# EAGLE design edubrm-shield (EAGLE 5.11)
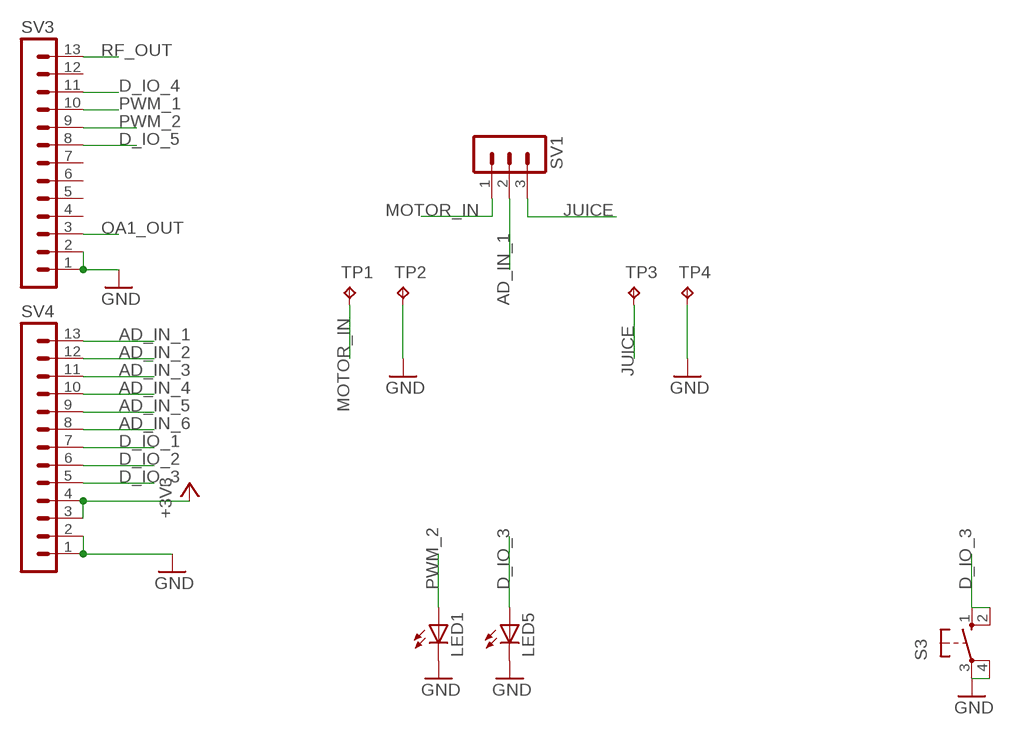
[diagram p0: schematic, sheet 1]

## Parts
LED1  LED3MM  [LED3MM]
LED5  LED3MM  [LED3MM]
S3  10-XX  [B3F-10XX]
SV1  MA03-1  [MA03-1]
SV3  MA13-1  [MA13-1]
SV4  MA13-1  [MA13-1]
TP1  TPPAD1-20Y  [P1-20Y]
TP2  TPPAD1-20Y  [P1-20Y]
TP3  TPPAD1-20Y  [P1-20Y]
TP4  TPPAD1-20Y  [P1-20Y]

## Nets
AD_IN_1: SV1.2 SV4.13
AD_IN_2: SV4.12
AD_IN_3: SV4.11
AD_IN_4: SV4.10
AD_IN_5: SV4.9
AD_IN_6: SV4.8
D_IO_1: SV4.7
D_IO_2: SV4.6
D_IO_3: LED5.A S3.1(S) S3.2(S1) SV4.5
D_IO_4: SV3.11
D_IO_5: SV3.8
GND: LED1.K(C) LED5.K(C) S3.3(P) S3.4(P1) SV3.1 SV3.2 SV4.1 SV4.2 TP2.TP TP4.TP
JUICE: SV1.3 TP3.TP
MOTOR_IN: SV1.1 TP1.TP
OA1_OUT: SV3.3
PWM_1: SV3.10
PWM_2: LED1.A SV3.9
RF_OUT: SV3.13
VCC: SV4.3 SV4.4 ; supply symbol labelled +3V3
Unconnected: SV3.4 SV3.5 SV3.6 SV3.7 SV3.12

## Library data of the parts
LED1 LED5 = led:LED: LED OSRAM: - CHIPLED LG R971, LG N971, LY N971, LG Q971, LY Q971, LO R971, LY R971 LH N974, LH R974 LS Q976, LO Q976, LY Q976 LO Q996 - Hyper CHIPLED LW Q18S LB Q993, LB Q99A, LB R99A - SideLED LS A670, LO A670, LY A670, LG A670, LP A670 LB A673, LV A673, LT A673, LW A673 LH A674 LY A675 LS A676, LA A676, LO A676, LY A676, LW A676 LS A679, LY A679, LG A679 - Hyper Micro SIDELED® LS Y876, LA Y876, LO Y876, LY Y876 LT Y87S - SmartLED LW L88C, LW L88S LB L89C, LB L89S, LG L890 LS L89K, LO L89K, LY L89K LS L896, LA L896, LO L896, LY L896 - TOPLED LS T670, LO T670, LY T670, LG T670, LP T670 LSG T670, LSP T670, LSY T670, LOP T670, LYG T670 LG T671, LOG T671, LSG T671 LB T673, LV T673, LT T673, LW T673 LH T674 LS T676, LA T676, LO T676, LY T676, LB T676, LH T676, LSB T676, LW T676 LB T67C, LV T67C, LT T67C, LS T67K, LO T67K, LY T67K, LW E67C LS E67B, LA E67B, LO E67B, LY E67B, LB E67C, LV E67C, LT E67C LW T67C LS T679, LY T679, LG T679 LS T770, LO T770, LY T770, LG T770, LP T770 LB T773, LV T773, LT T773, LW T773 LH T774 LS E675, LA E675, LY E675, LS T675 LS T776, LA T776, LO T776, LY T776, LB T776 LHGB T686 LT T68C, LB T68C - Hyper Mini TOPLED® LB M676 - Mini TOPLED Santana® LG M470 LS M47K, LO M47K, LY M47K Source: http://www.osram.convergy.de LUXEON: - LUMILED® LXK2-PW12-R00, LXK2-PW12-S00, LXK2-PW14-U00, LXK2-PW14-V00 LXK2-PM12-R00, LXK2-PM12-S00, LXK2-PM14-U00 LXK2-PE12-Q00, LXK2-PE12-R00, LXK2-PE12-S00, LXK2-PE14-T00, LXK2-PE14-U00 LXK2-PB12-K00, LXK2-PB12-L00, LXK2-PB12-M00, LXK2-PB14-N00, LXK2-PB14-P00, LXK2-PB14-Q00 LXK2-PR12-L00, LXK2-PR12-M00, LXK2-PR14-Q00, LXK2-PR14-R00 LXK2-PD12-Q00, LXK2-PD12-R00, LXK2-PD12-S00 LXK2-PH12-R00, LXK2-PH12-S00 LXK2-PL12-P00, LXK2-PL12-Q00, LXK2-PL12-R00 Source: www.luxeon.com KINGBRIGHT: KA-3528ASYC Source: www.kingbright.com
S3 = switch-omron:10-XX: OMRON SWITCH; MPN: B3F-1000; OC_FARNELL: 176432; OC_NEWARK: 36M3542
SV1 = con-lstb:MA03-1: PIN HEADER; OC_FARNELL: unknown; OC_NEWARK: unknown
SV3 SV4 = con-lstb:MA13-1: PIN HEADER; OC_FARNELL: unknown; OC_NEWARK: unknown
TP1-TP4 = testpad:TP: Test pad

## Board
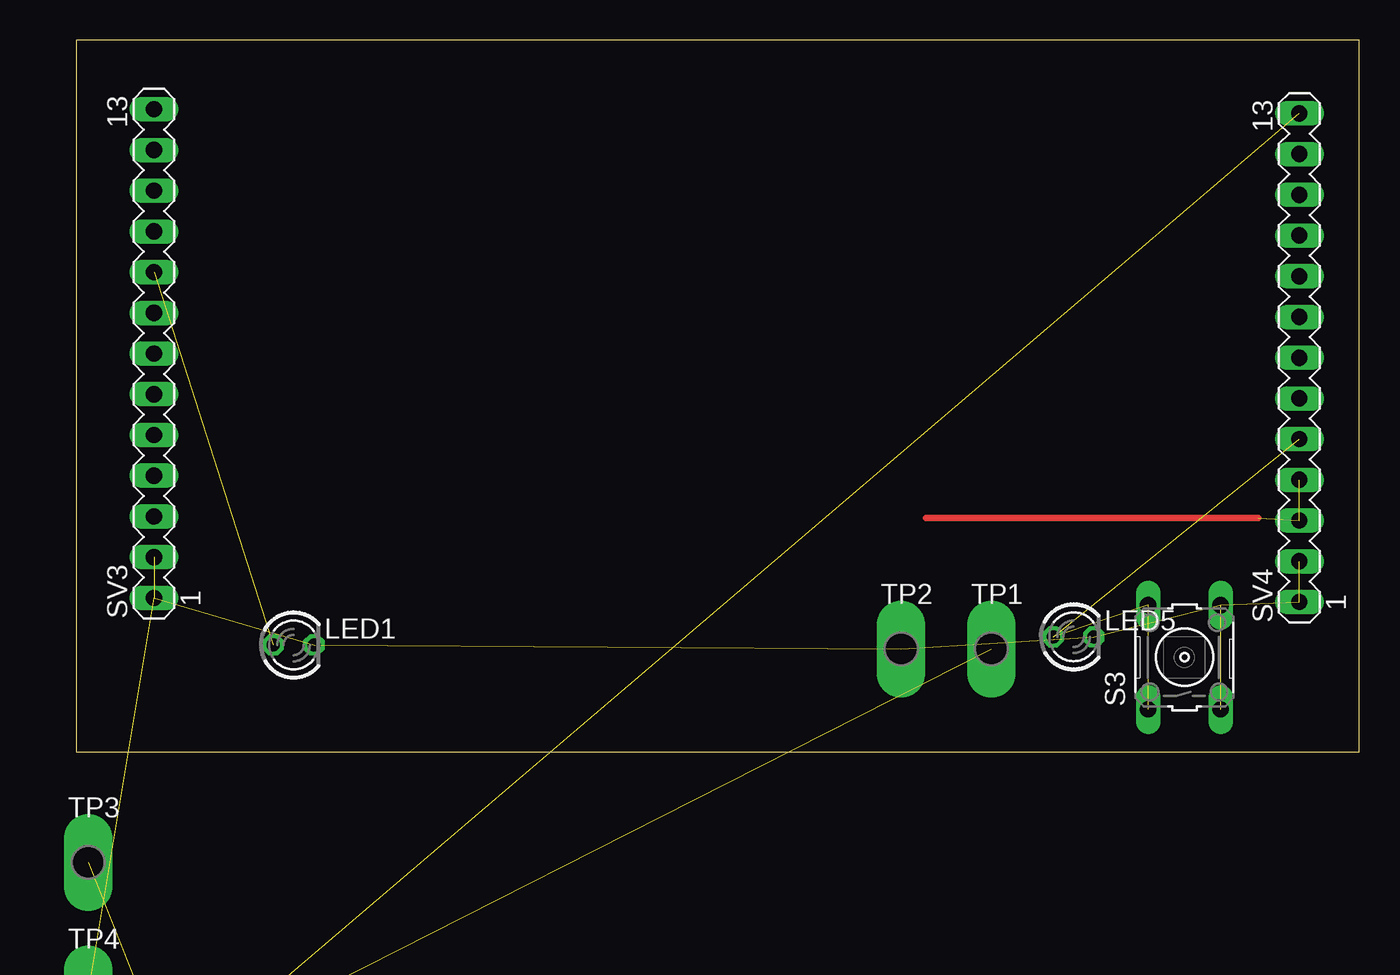
[diagram p1: board, top side]
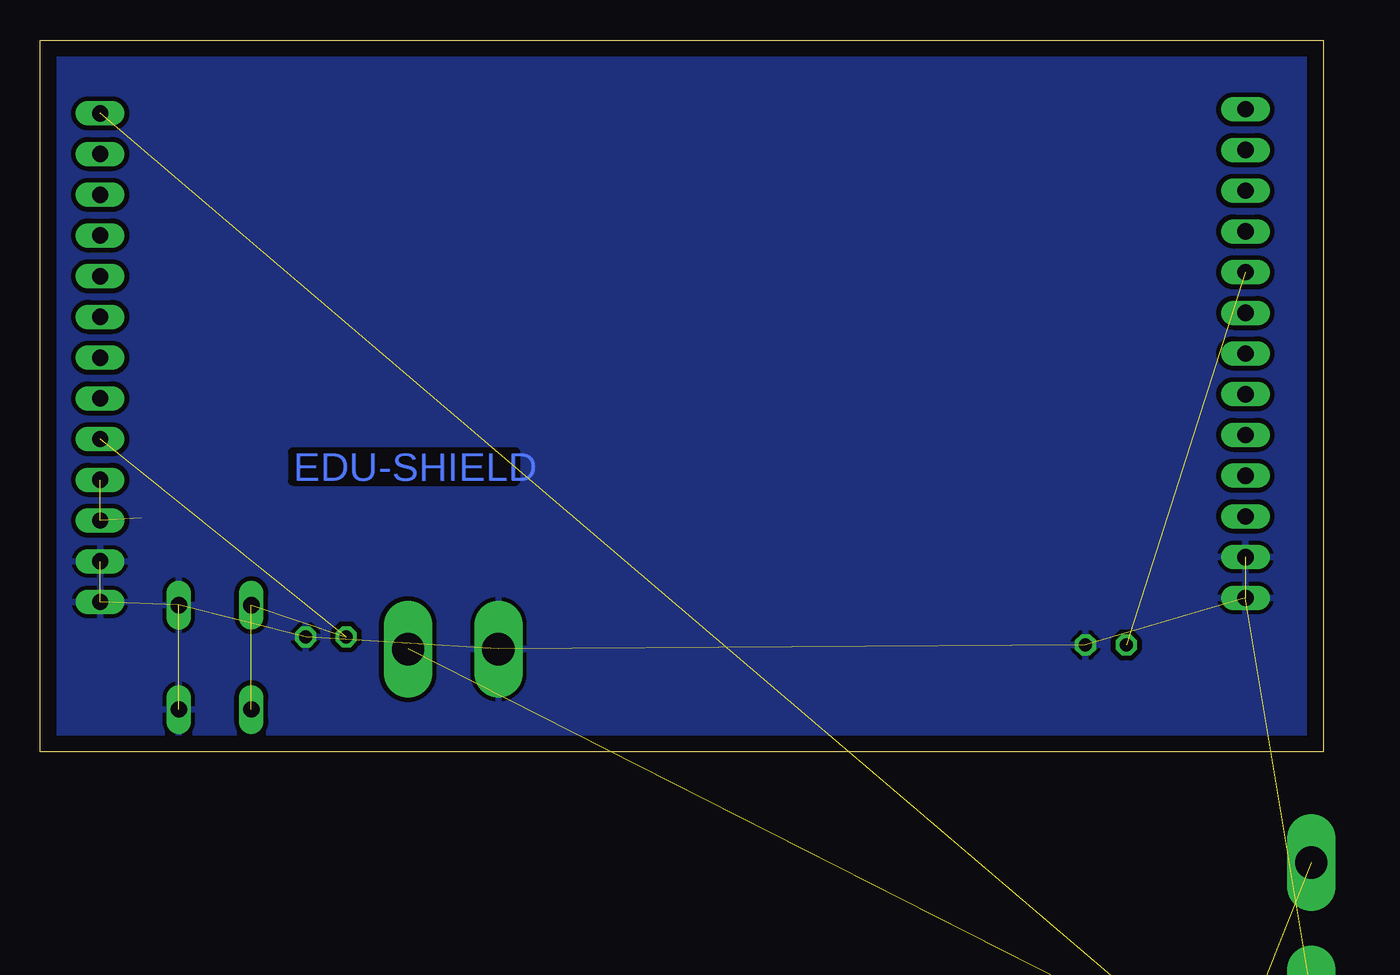
[diagram p2: board, bottom side, seen from below]

Size 80.03 x 44.38 mm. Coordinates in mm from the lower left corner, seen from the top.
Outline: 0,0 80.03,0 80.03,44.38 0,44.38 0,0
Copper layers (1*16): Top 0.035mm / dielectric 1.5mm / Bottom 0.035mm
Design rules "default *": minimum track width 10mil, minimum drill 24mil, track to track 12mil, track to pad 12mil, pad to pad 8mil, via to via 8mil, smd to smd 8mil, copper to edge 40mil, drill to drill 8mil, minimum pad ring 10mil, minimum via ring 8mil, stop-mask expansion 4mil, vias tented up to drill 0mil, thermal gap 10mil

### Footprints (pad centres in the part's own frame; a part is rotated, then mirrored left to right if it is on the bottom)
LED3MM = drill 0.813 octagon: A -1.27,0; K 1.27,0
B3F-10XX = drill 1.016 long: 1 -3.251,2.261; 2 3.251,2.261; 3 -3.251,-2.261; 4 3.251,-2.261
MA03-1 = drill 1.016 long: 1 -2.54,0; 2 0,0; 3 2.54,0
MA13-1 = drill 1.016 long: 1 -15.24,0; 2 -12.7,0; 3 -10.16,0; 4 -7.62,0; 5 -5.08,0; 6 -2.54,0; 7 0,0; 8 2.54,0; 9 5.08,0; 10 7.62,0; 11 10.16,0; 12 12.7,0; 13 15.24,0
P1-20Y = drill 2.007 pad 2.54 long: TP 0,0

### Placement (x,y rotation side)
LED1  13.57,6.66 0 top
LED5  62.21,7.17 0 top
S3  69.12,5.89 90 top
SV1  4.1,-21.76 0 top  (outside the outline)
SV3  4.86,24.83 90 top
SV4  76.29,24.58 90 top
TP1  57.09,6.4 0 top
TP2  51.46,6.4 0 top
TP3  0.77,-6.91 0 top  (outside the outline)
TP4  0.77,-15.1 0 top  (outside the outline)

### Tracks (layer width: path | path; a pad name or v marks a point on that pad's centre or on a via)
AD_IN_1  (1 unrouted)
D_IO_3  (3 unrouted)
GND  (9 unrouted)
  pour Bottom: -1.54,45.57 81.66,45.57 81.66,-1.79 -1.54,-1.79
JUICE  (1 unrouted)
MOTOR_IN  (1 unrouted)
PWM_2  (1 unrouted)
VCC  (2 unrouted)
  Top 0.406: 52.99,14.59 73.73,14.59

### Text on the board
Bottom: EDU-SHIELD